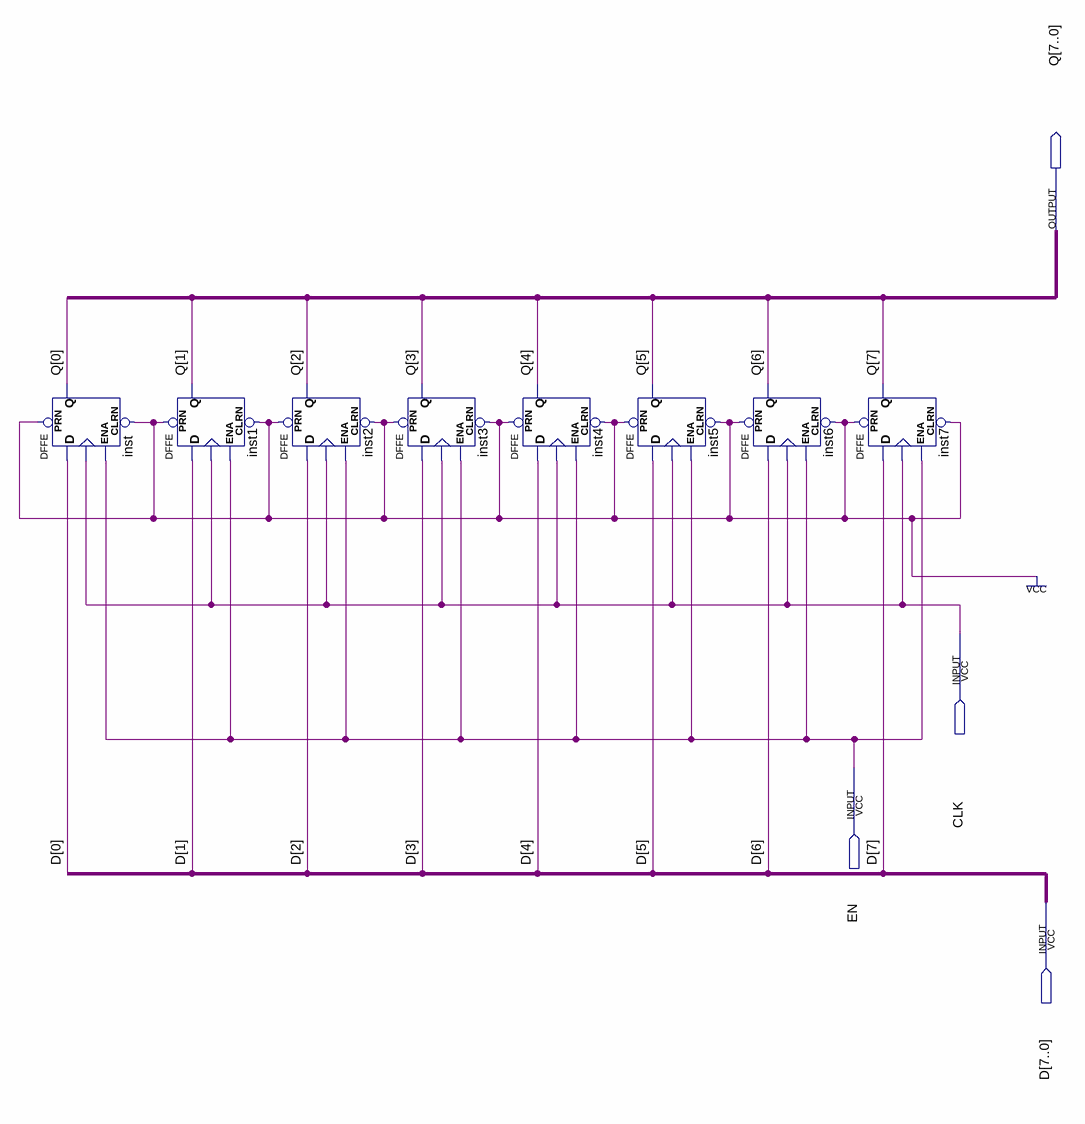
[diagram p0: schematic sheet]
// Quartus schematic reg_async_8b.bdf as structural Verilog: 8 symbols, 4 pins
module reg_async_8b (
  input  CLK,
  input  EN,
  input  [7:0] D,
  output [7:0] Q
);

  DFFE inst (.PRN(1'b1), .CLRN(1'b1), .D(D[0]), .CLK(CLK), .ENA(EN), .Q(Q[0]));
  DFFE inst1 (.PRN(1'b1), .CLRN(1'b1), .D(D[1]), .CLK(CLK), .ENA(EN), .Q(Q[1]));
  DFFE inst2 (.PRN(1'b1), .CLRN(1'b1), .D(D[2]), .CLK(CLK), .ENA(EN), .Q(Q[2]));
  DFFE inst3 (.PRN(1'b1), .CLRN(1'b1), .D(D[3]), .CLK(CLK), .ENA(EN), .Q(Q[3]));
  DFFE inst4 (.PRN(1'b1), .CLRN(1'b1), .D(D[4]), .CLK(CLK), .ENA(EN), .Q(Q[4]));
  DFFE inst5 (.PRN(1'b1), .CLRN(1'b1), .D(D[5]), .CLK(CLK), .ENA(EN), .Q(Q[5]));
  DFFE inst6 (.PRN(1'b1), .CLRN(1'b1), .D(D[6]), .CLK(CLK), .ENA(EN), .Q(Q[6]));
  DFFE inst7 (.PRN(1'b1), .CLRN(1'b1), .D(D[7]), .CLK(CLK), .ENA(EN), .Q(Q[7]));
endmodule
